# EAGLE design GPIO_Adapter (EAGLE 9.6.2)
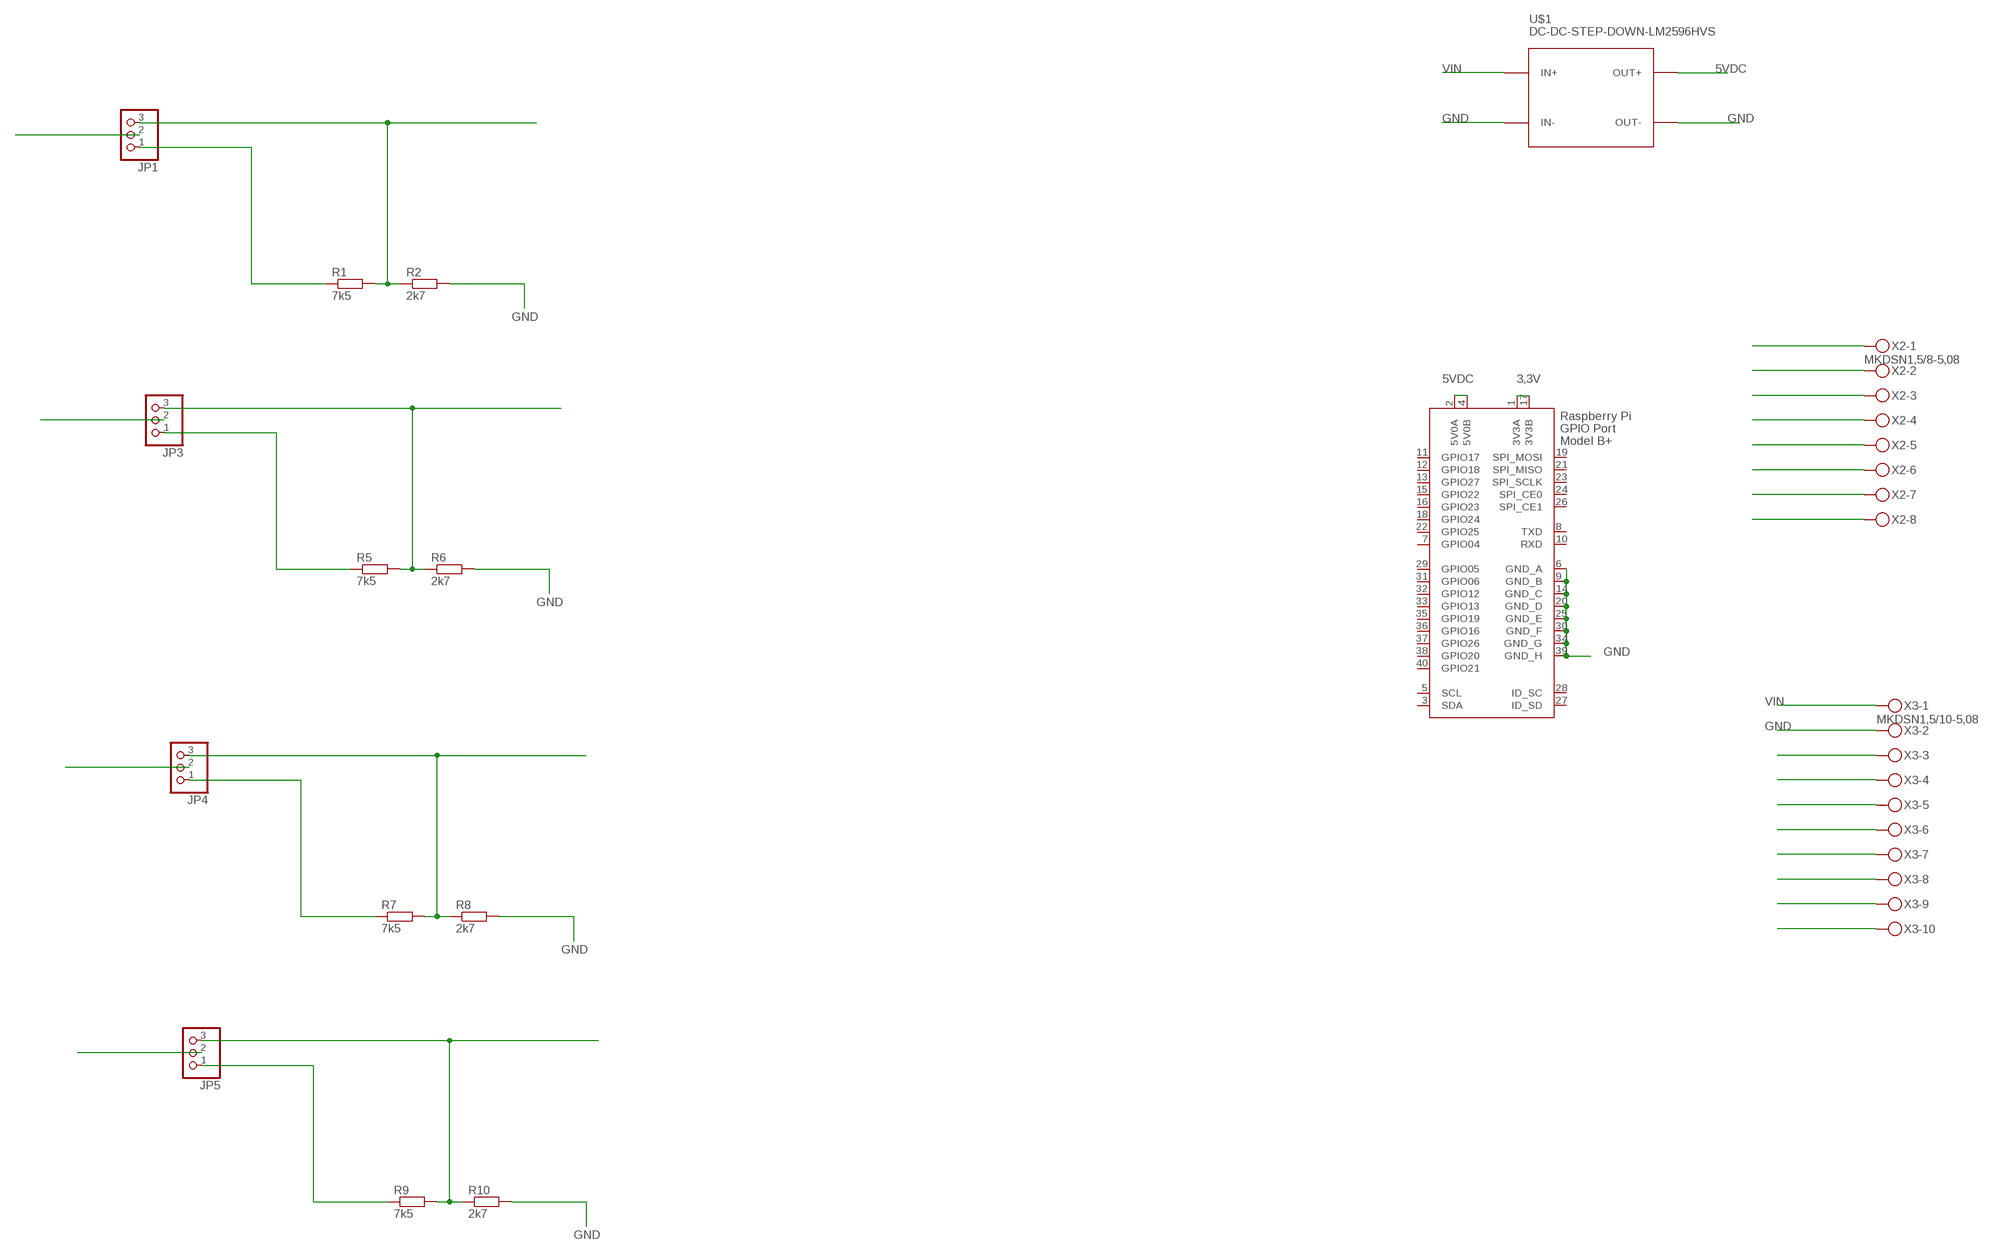
[diagram p0: schematic, sheet 1, part 1 of 3]
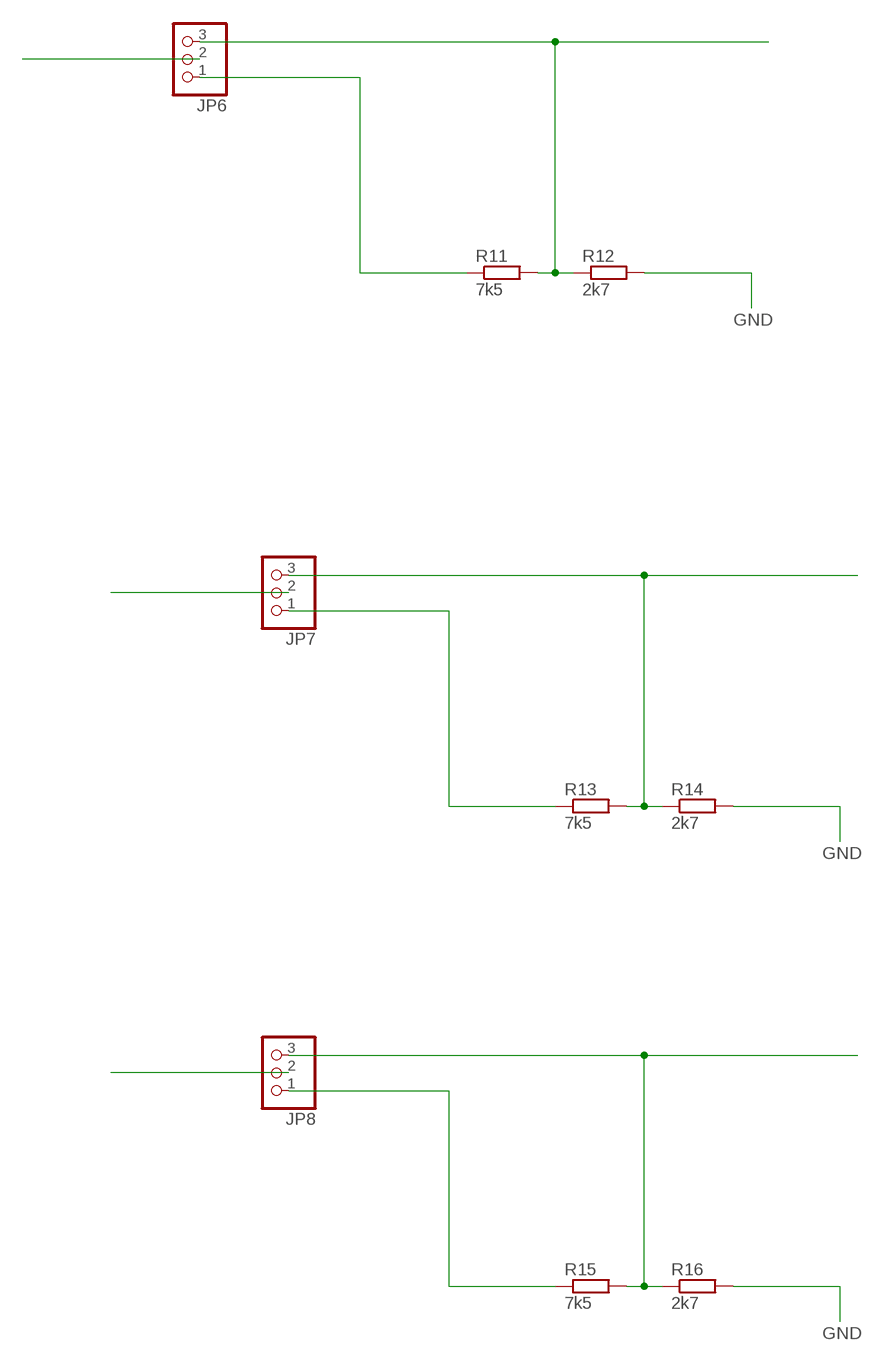
[diagram p1: schematic, sheet 1, part 2 of 3]
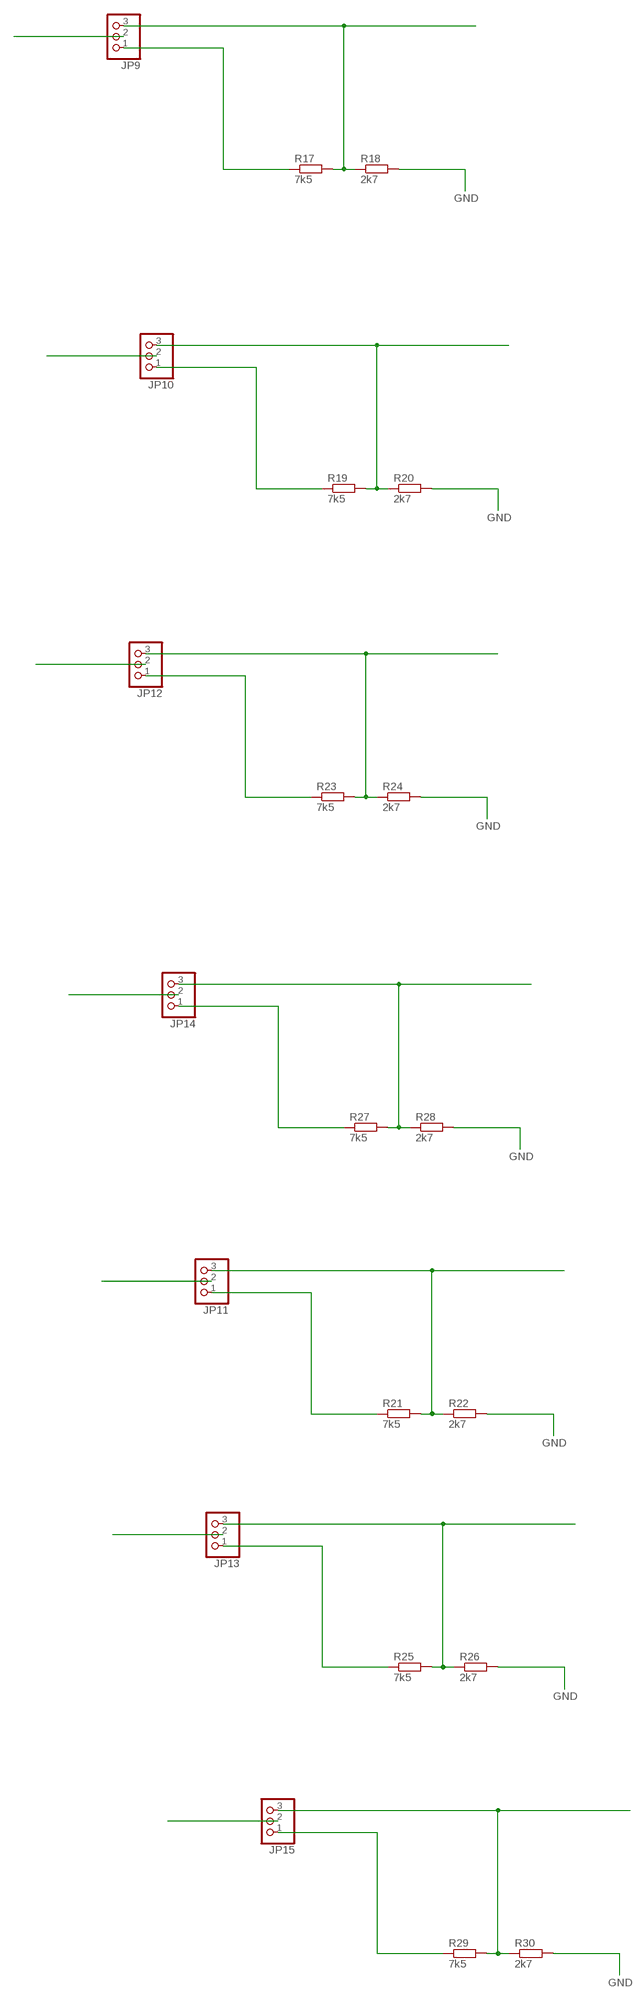
[diagram p2: schematic, sheet 1, part 3 of 3]

## Parts
JP1  PINHD-1X3  [1X03]
JP3  PINHD-1X3  [1X03]
JP4  PINHD-1X3  [1X03]
JP5  PINHD-1X3  [1X03]
JP6  PINHD-1X3  [1X03]
JP7  PINHD-1X3  [1X03]
JP8  PINHD-1X3  [1X03]
JP9  PINHD-1X3  [1X03]
JP10  PINHD-1X3  [1X03]
JP11  PINHD-1X3  [1X03]
JP12  PINHD-1X3  [1X03]
JP13  PINHD-1X3  [1X03]
JP14  PINHD-1X3  [1X03]
JP15  PINHD-1X3  [1X03]
R1  7k5  R-EU_R0805  [R0805]
R2  2k7  R-EU_R0805  [R0805]
R5  7k5  R-EU_R0805  [R0805]
R6  2k7  R-EU_R0805  [R0805]
R7  7k5  R-EU_R0805  [R0805]
R8  2k7  R-EU_R0805  [R0805]
R9  7k5  R-EU_R0805  [R0805]
R10  2k7  R-EU_R0805  [R0805]
R11  7k5  R-EU_R0805  [R0805]
R12  2k7  R-EU_R0805  [R0805]
R13  7k5  R-EU_R0805  [R0805]
R14  2k7  R-EU_R0805  [R0805]
R15  7k5  R-EU_R0805  [R0805]
R16  2k7  R-EU_R0805  [R0805]
R17  7k5  R-EU_R0805  [R0805]
R18  2k7  R-EU_R0805  [R0805]
R19  7k5  R-EU_R0805  [R0805]
R20  2k7  R-EU_R0805  [R0805]
R21  7k5  R-EU_R0805  [R0805]
R22  2k7  R-EU_R0805  [R0805]
R23  7k5  R-EU_R0805  [R0805]
R24  2k7  R-EU_R0805  [R0805]
R25  7k5  R-EU_R0805  [R0805]
R26  2k7  R-EU_R0805  [R0805]
R27  7k5  R-EU_R0805  [R0805]
R28  2k7  R-EU_R0805  [R0805]
R29  7k5  R-EU_R0805  [R0805]
R30  2k7  R-EU_R0805  [R0805]
U$1  DC-DC-STEP-DOWN-LM2596HVS  [DC-DC-STEP-DOWN-LM2596HVS]
X1  RASPI_BOARD_B+#_F  [RASPI_BOARD_B+_FULL]
X2  MKDSN1,5/8-5,08  [MKDSN1,5/8-5,08]
X3  MKDSN1,5/10-5,08  [MKDSN1,5/10-5,08]

## Nets
3,3V: X1.1(3V3A) X1.17(3V3B)
5VDC: U$1.OUT+ X1.2(5V0A) X1.4(5V0B)
GND: R2.2 R6.2 R8.2 R10.2 R12.2 R14.2 R16.2 R18.2 R20.2 R22.2 R24.2 R26.2 R28.2 R30.2 U$1.IN- U$1.OUT- X1.6(GND_A) X1.9(GND_B) X1.14(GND_C) X1.20(GND_D) X1.25(GND_E) X1.30(GND_F) X1.34(GND_G) X1.39(GND_H) X3.2
N$1: X2.1
N$2: X2.2
N$3: X2.3
N$4: X2.4
N$5: X2.5
N$6: X2.6
N$7: X2.7
N$8: X2.8
N$9: JP1.1 R1.1
N$10: JP1.3 R1.2 R2.1
N$11: X3.3
N$12: X3.4
N$13: X3.5
N$14: X3.6
N$15: X3.7
N$16: X3.8
N$17: X3.9
N$18: X3.10
N$20: JP1.2
N$21: JP3.1 R5.1
N$22: JP3.3 R5.2 R6.1
N$23: JP3.2
N$24: JP4.1 R7.1
N$25: JP4.3 R7.2 R8.1
N$26: JP4.2
N$27: JP5.1 R9.1
N$28: JP5.3 R9.2 R10.1
N$29: JP5.2
N$30: JP6.1 R11.1
N$31: JP6.3 R11.2 R12.1
N$32: JP6.2
N$33: JP7.1 R13.1
N$34: JP7.3 R13.2 R14.1
N$35: JP7.2
N$36: JP8.1 R15.1
N$37: JP8.3 R15.2 R16.1
N$38: JP8.2
N$39: JP9.1 R17.1
N$40: JP9.3 R17.2 R18.1
N$41: JP9.2
N$42: JP10.1 R19.1
N$43: JP10.3 R19.2 R20.1
N$44: JP10.2
N$45: JP11.1 R21.1
N$46: JP11.3 R21.2 R22.1
N$47: JP11.2
N$48: JP12.1 R23.1
N$49: JP12.3 R23.2 R24.1
N$50: JP12.2
N$51: JP13.1 R25.1
N$52: JP13.3 R25.2 R26.1
N$53: JP13.2
N$54: JP14.1 R27.1
N$55: JP14.3 R27.2 R28.1
N$56: JP14.2
N$57: JP15.1 R29.1
N$58: JP15.3 R29.2 R30.1
N$59: JP15.2
VIN: U$1.IN+ X3.1
Unconnected: X1.3(SDA) X1.5(SCL) X1.7(GPIO04) X1.8(TXD) X1.10(RXD) X1.11(GPIO17) X1.12(GPIO18) X1.13(GPIO27) X1.15(GPIO22) X1.16(GPIO23) X1.18(GPIO24) X1.19(SPI_MOSI) X1.21(SPI_MISO) X1.22(GPIO25) X1.23(SPI_SCLK) X1.24(SPI_CE0) X1.26(SPI_CE1) X1.27(ID_SD) X1.28(ID_SC) X1.29(GPIO05) X1.31(GPIO06) X1.32(GPIO12) X1.33(GPIO13) X1.35(GPIO19) X1.36(GPIO16) X1.37(GPIO26) X1.38(GPIO20) X1.40(GPIO21)

## Library data of the parts
JP1 JP3-JP15 = pinhead:PINHD-1X3: PIN HEADER
R1 R2 R5-R30 = rcl:R-EU_: RESISTOR, European symbol
U$1 = diy-modules:DC-DC-STEP-DOWN-LM2596HVS: DC/DC Step-Down Regulator based on LM2596-ADJ chip LM2596 datasheet available here: http://www.ti.com/lit/ds/symlink/lm2596.pdf Click here to find device on ebay.com <http://www.ebay.com/sch/lm2596+power+regulator>
X1 = raspberrypi_bastelstube_v13:RASPI_BOARD_B+#: Raspberry Pi GPIO connector with markings for the outer dimensions of the Raspberry Pi board model B+ with different sets of drill holes or mounting pads All pins connected
X2 = con-phoenix-508:MKDSN1,5/8-5,08: MKDSN 1,5/ 8-5,08 Printklemme Nennstrom: 13,5 A Nennspannung: 250 V Rastermaß: 5,08 mm Polzahl: 8 Anschlussart: Schraubanschluss Montage: Löten Anschlussrichtung Leiter/Platine: 0 ° Artikelnummer: 1729186 Source: http://eshop.phoenixcontact.com .. 1729186.pdf
X3 = con-phoenix-508:MKDSN1,5/10-5,08: MKDSN 1,5/10-5,08 Printklemme Nennstrom: 13,5 A Nennspannung: 250 V Rastermaß: 5,08 mm Polzahl: 10 Anschlussart: Schraubanschluss Montage: Löten Anschlussrichtung Leiter/Platine: 0 ° Artikelnummer: 1729209 Source: http://eshop.phoenixcontact.com .. 1729209.pdf

## Board
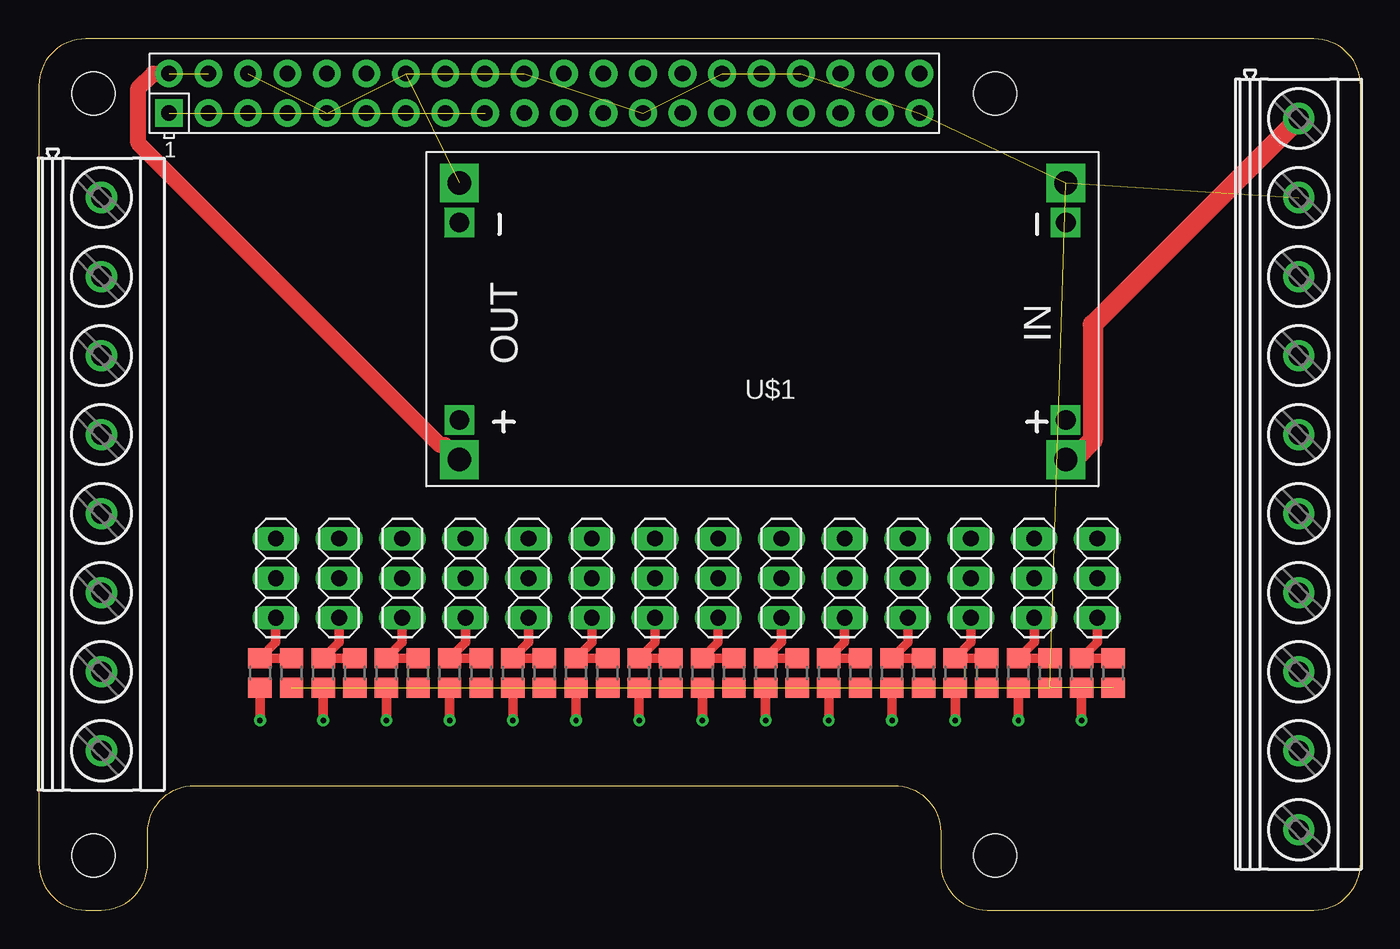
[diagram p3: board, top side]
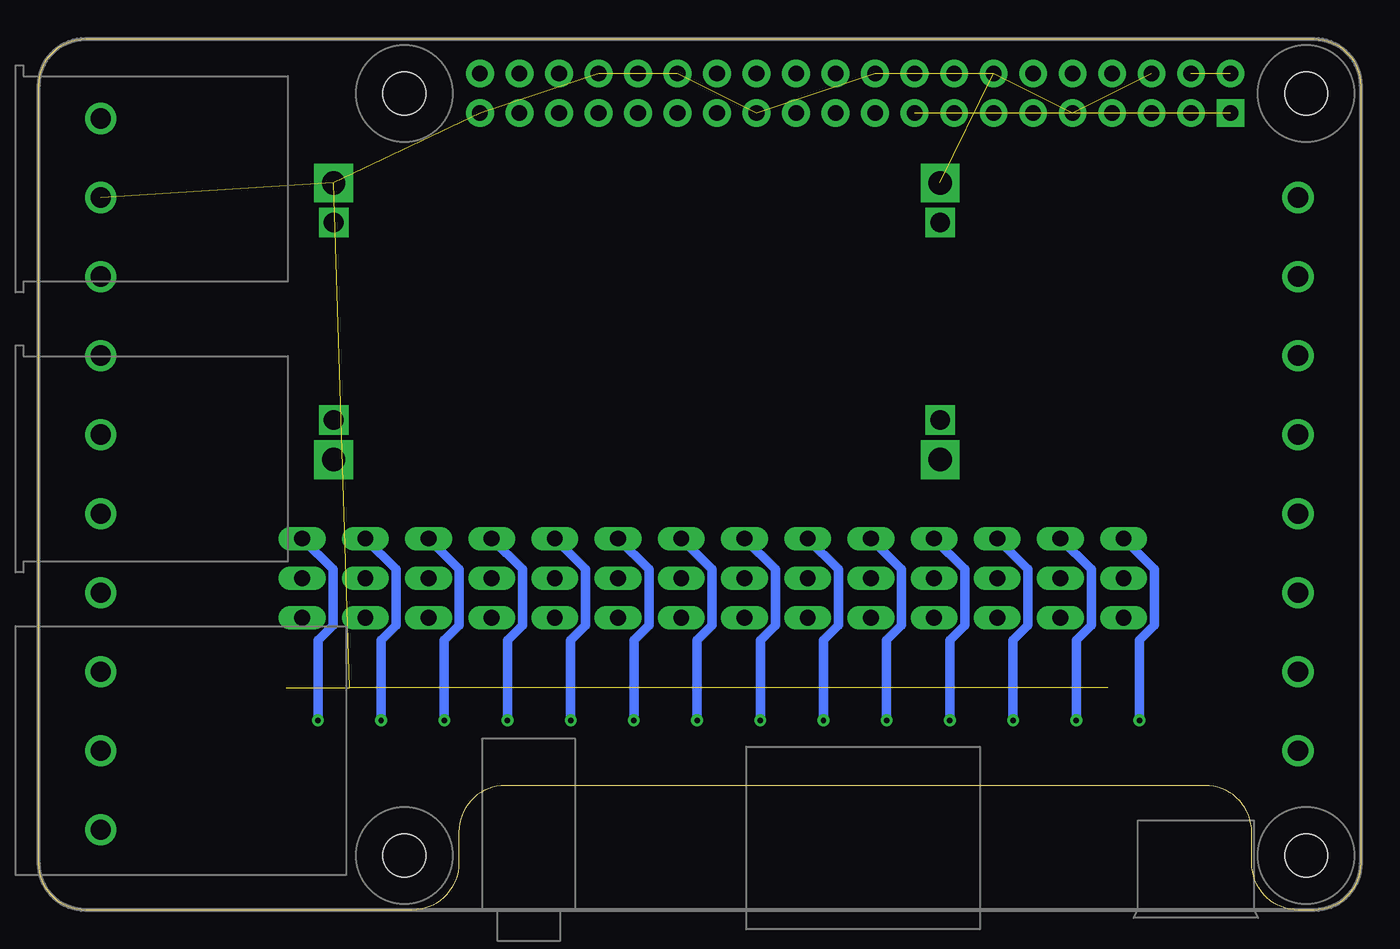
[diagram p4: board, bottom side, seen from below]

Size 85 x 56 mm. Coordinates in mm from the lower left corner, seen from the top.
Outline: 82,56 3,56 arc90 0,53 0,3 arc90 3,0 4,0 arc90 7,3 7,5 arc-90 10,8 55,8 arc-90 58,5 58,3 arc90 61,0 82,0 arc90 85,3 85,53 arc90 82,56
Copper layers (1*16): Top 0.035mm / dielectric 1.5mm / Bottom 0.035mm
Design rules "default": minimum track width 6mil, minimum drill 0.35mm, track to track 6mil, track to pad 6mil, pad to pad 6mil, via to via 6mil, smd to smd 6mil, copper to edge 40mil, drill to drill 6mil, minimum pad ring 10mil, minimum via ring 8mil, stop-mask expansion 4mil, vias tented up to drill 0mil, thermal gap 10mil

### Footprints (pad centres in the part's own frame; a part is rotated, then mirrored left to right if it is on the bottom)
1X03 = drill 1.016 long: 1 -2.54,0; 2 0,0; 3 2.54,0
R0805 = smd 1.3 x 1.5: 1 -0.95,0; 2 0.95,0
DC-DC-STEP-DOWN-LM2596HVS = drill 1.5 pad 2.5 square: IN+ 0,17.78; IN- 0,0; OUT+ 39,17.78; OUT- 39,0 | drill 1.27 pad 1.676 square: P$1 0,15.24; P$6 0,2.54; P$7 39,15.24; P$8 39,2.54
RASPI_BOARD_B+_FULL = drill 1 pad 1.778 square: 1 8.37,51.23 | drill 1 pad 1.778: 2 8.37,53.77; 3 10.91,51.23; 4 10.91,53.77; 5 13.45,51.23; 6 13.45,53.77; 7 15.99,51.23; 8 15.99,53.77; 9 18.53,51.23; 10 18.53,53.77; 11 21.07,51.23; 12 21.07,53.77; 13 23.61,51.23; 14 23.61,53.77; 15 26.15,51.23; 16 26.15,53.77; 17 28.69,51.23; 18 28.69,53.77; 19 31.23,51.23; 20 31.23,53.77; 21 33.77,51.23; 22 33.77,53.77; 23 36.31,51.23; 24 36.31,53.77; 25 38.85,51.23; 26 38.85,53.77; 27 41.39,51.23; 28 41.39,53.77; 29 43.93,51.23; 30 43.93,53.77; 31 46.47,51.23; 32 46.47,53.77; 33 49.01,51.23; 34 49.01,53.77; 35 51.55,51.23; 36 51.55,53.77; 37 54.09,51.23; 38 54.09,53.77; 39 56.63,51.23; 40 56.63,53.77 | hole 2.75: 3.5,3.5; 3.5,52.5; 61.5,3.5; 61.5,52.5
MKDSN1,5/8-5,08 = drill 1.3 pad 2: 1 -17.801,0.025; 2 -12.721,0.025; 3 -7.641,0.025; 4 -2.561,0.025; 5 2.519,0.025; 6 7.599,0.025; 7 12.679,0.025; 8 17.759,0.025
MKDSN1,5/10-5,08 = drill 1.3 pad 2: 1 -22.881,0.025; 2 -17.801,0.025; 3 -12.721,0.025; 4 -7.641,0.025; 5 -2.561,0.025; 6 2.519,0.025; 7 7.599,0.025; 8 12.679,0.025; 9 17.759,0.025; 10 22.839,0.025

### Placement (x,y rotation side)
JP1  15.24,21.34 270 top
JP3  19.3,21.34 270 top
JP4  23.37,21.34 270 top
JP5  27.43,21.34 270 top
JP6  31.5,21.34 270 top
JP7  35.56,21.34 270 top
JP8  39.62,21.34 270 top
JP9  43.69,21.34 270 top
JP10  47.75,21.34 270 top
JP11  59.94,21.34 270 top
JP12  51.82,21.34 270 top
JP13  64.01,21.34 270 top
JP14  55.88,21.34 270 top
JP15  68.07,21.34 270 top
R1  14.22,15.24 90 top
R2  16.26,15.24 270 top
R5  18.29,15.24 90 top
R6  20.32,15.24 270 top
R7  22.35,15.24 90 top
R8  24.38,15.24 270 top
R9  26.42,15.24 90 top
R10  28.45,15.24 270 top
R11  30.48,15.24 90 top
R12  32.51,15.24 270 top
R13  34.54,15.24 90 top
R14  36.58,15.24 270 top
R15  38.61,15.24 90 top
R16  40.64,15.24 270 top
R17  42.67,15.24 90 top
R18  44.7,15.24 270 top
R19  46.74,15.24 90 top
R20  48.77,15.24 270 top
R21  58.93,15.24 90 top
R22  60.96,15.24 270 top
R23  50.8,15.24 90 top
R24  52.83,15.24 270 top
R25  62.99,15.24 90 top
R26  65.02,15.24 270 top
R27  54.86,15.24 90 top
R28  56.9,15.24 270 top
R29  67.06,15.24 90 top
R30  69.09,15.24 270 top
U$1  66.04,46.74 180 top
X1  0,0 0 top
X2  4,28 270 top
X3  81,28 270 top

### Tracks (layer width: path | path; a pad name or v marks a point on that pad's centre or on a via)
3,3V  (1 unrouted)
5VDC  (1 unrouted)
  Top 1.016: U$1.OUT+ 26.11,29.88 25.81,29.88 6.4,49.3 6.4,52.83 7.34,53.77 X1.2
GND  (24 unrouted)
N$9  (via drill 0.35)
  Top 0.61: R1.1 v14.22,12.19
  Bottom 0.61: v14.22,12.19 14.22,17.33 13.26,18.29 13.26,21.89 JP1.1
N$10
  Top 0.61: R2.1 R1.2 15.24,17.21 JP1.3
N$21  (via drill 0.35)
  Top 0.61: R5.1 v18.29,12.19
  Bottom 0.61: v18.29,12.19 18.29,17.33 17.32,18.29 17.32,21.89 JP3.1
N$22
  Top 0.61: R6.1 R5.2 19.3,17.21 JP3.3
N$24  (via drill 0.35)
  Top 0.61: R7.1 v22.35,12.19
  Bottom 0.61: v22.35,12.19 22.35,17.33 21.39,18.29 21.39,21.89 JP4.1
N$25
  Top 0.61: R8.1 R7.2 23.37,17.21 JP4.3
N$27  (via drill 0.35)
  Top 0.61: R9.1 v26.42,12.19
  Bottom 0.61: v26.42,12.19 26.42,17.33 25.45,18.29 25.45,21.89 JP5.1
N$28
  Top 0.61: R10.1 R9.2 27.43,17.21 JP5.3
N$30  (via drill 0.35)
  Top 0.61: R11.1 v30.48,12.19
  Bottom 0.61: v30.48,12.19 30.48,17.33 29.52,18.29 29.52,21.89 JP6.1
N$31
  Top 0.61: R12.1 R11.2 31.5,17.21 JP6.3
N$33  (via drill 0.35)
  Top 0.61: R13.1 v34.54,12.19
  Bottom 0.61: v34.54,12.19 34.54,17.33 33.58,18.29 33.58,21.89 JP7.1
N$34
  Top 0.61: R14.1 R13.2 35.56,17.21 JP7.3
N$36  (via drill 0.35)
  Top 0.61: R15.1 v38.61,12.19
  Bottom 0.61: v38.61,12.19 38.61,17.33 37.64,18.29 37.64,21.89 JP8.1
N$37
  Top 0.61: R16.1 R15.2 39.62,17.21 JP8.3
N$39  (via drill 0.35)
  Top 0.61: R17.1 v42.67,12.19
  Bottom 0.61: v42.67,12.19 42.67,17.33 41.71,18.29 41.71,21.89 JP9.1
N$40
  Top 0.61: R18.1 R17.2 43.69,17.21 JP9.3
N$42  (via drill 0.35)
  Top 0.61: R19.1 v46.74,12.19
  Bottom 0.61: v46.74,12.19 46.74,17.33 45.77,18.29 45.77,21.89 JP10.1
N$43
  Top 0.61: R20.1 R19.2 47.75,17.21 JP10.3
N$45  (via drill 0.35)
  Top 0.61: R21.1 v58.93,12.19
  Bottom 0.61: v58.93,12.19 58.93,17.33 57.96,18.29 57.96,21.89 JP11.1
N$46
  Top 0.61: R22.1 R21.2 59.94,17.21 JP11.3
N$48  (via drill 0.35)
  Top 0.61: R23.1 v50.8,12.19
  Bottom 0.61: v50.8,12.19 50.8,17.33 49.84,18.29 49.84,21.89 JP12.1
N$49
  Top 0.61: R24.1 R23.2 51.82,17.21 JP12.3
N$51  (via drill 0.35)
  Top 0.61: R25.1 v62.99,12.19
  Bottom 0.61: v62.99,12.19 62.99,17.33 62.03,18.29 62.03,21.89 JP13.1
N$52
  Top 0.61: R26.1 R25.2 64.01,17.21 JP13.3
N$54  (via drill 0.35)
  Top 0.61: R27.1 v54.86,12.19
  Bottom 0.61: v54.86,12.19 54.86,17.33 53.9,18.29 53.9,21.89 JP14.1
N$55
  Top 0.61: R28.1 R27.2 55.88,17.21 JP14.3
N$57  (via drill 0.35)
  Top 0.61: R29.1 v67.06,12.19
  Bottom 0.61: v67.06,12.19 67.06,17.33 66.09,18.29 66.09,21.89 JP15.1
N$58
  Top 0.61: R30.1 R29.2 68.07,17.21 JP15.3
VIN
  Top 1.27: X3.1 67.78,37.64 67.78,30.19 66.55,28.96 U$1.IN+